# Altium schematic sheet BW1097_EthernetSchDoc.SchDoc: =project_title
size Tabloid; CompanyName: Luxonis Holding; Organization: Luxonis Holding; Address1: 1925 Harmony Park Drive; Address2: Westminster, CO; Address3: 80234; Address4: United States; SheetNumber: 16; SheetTotal: 17
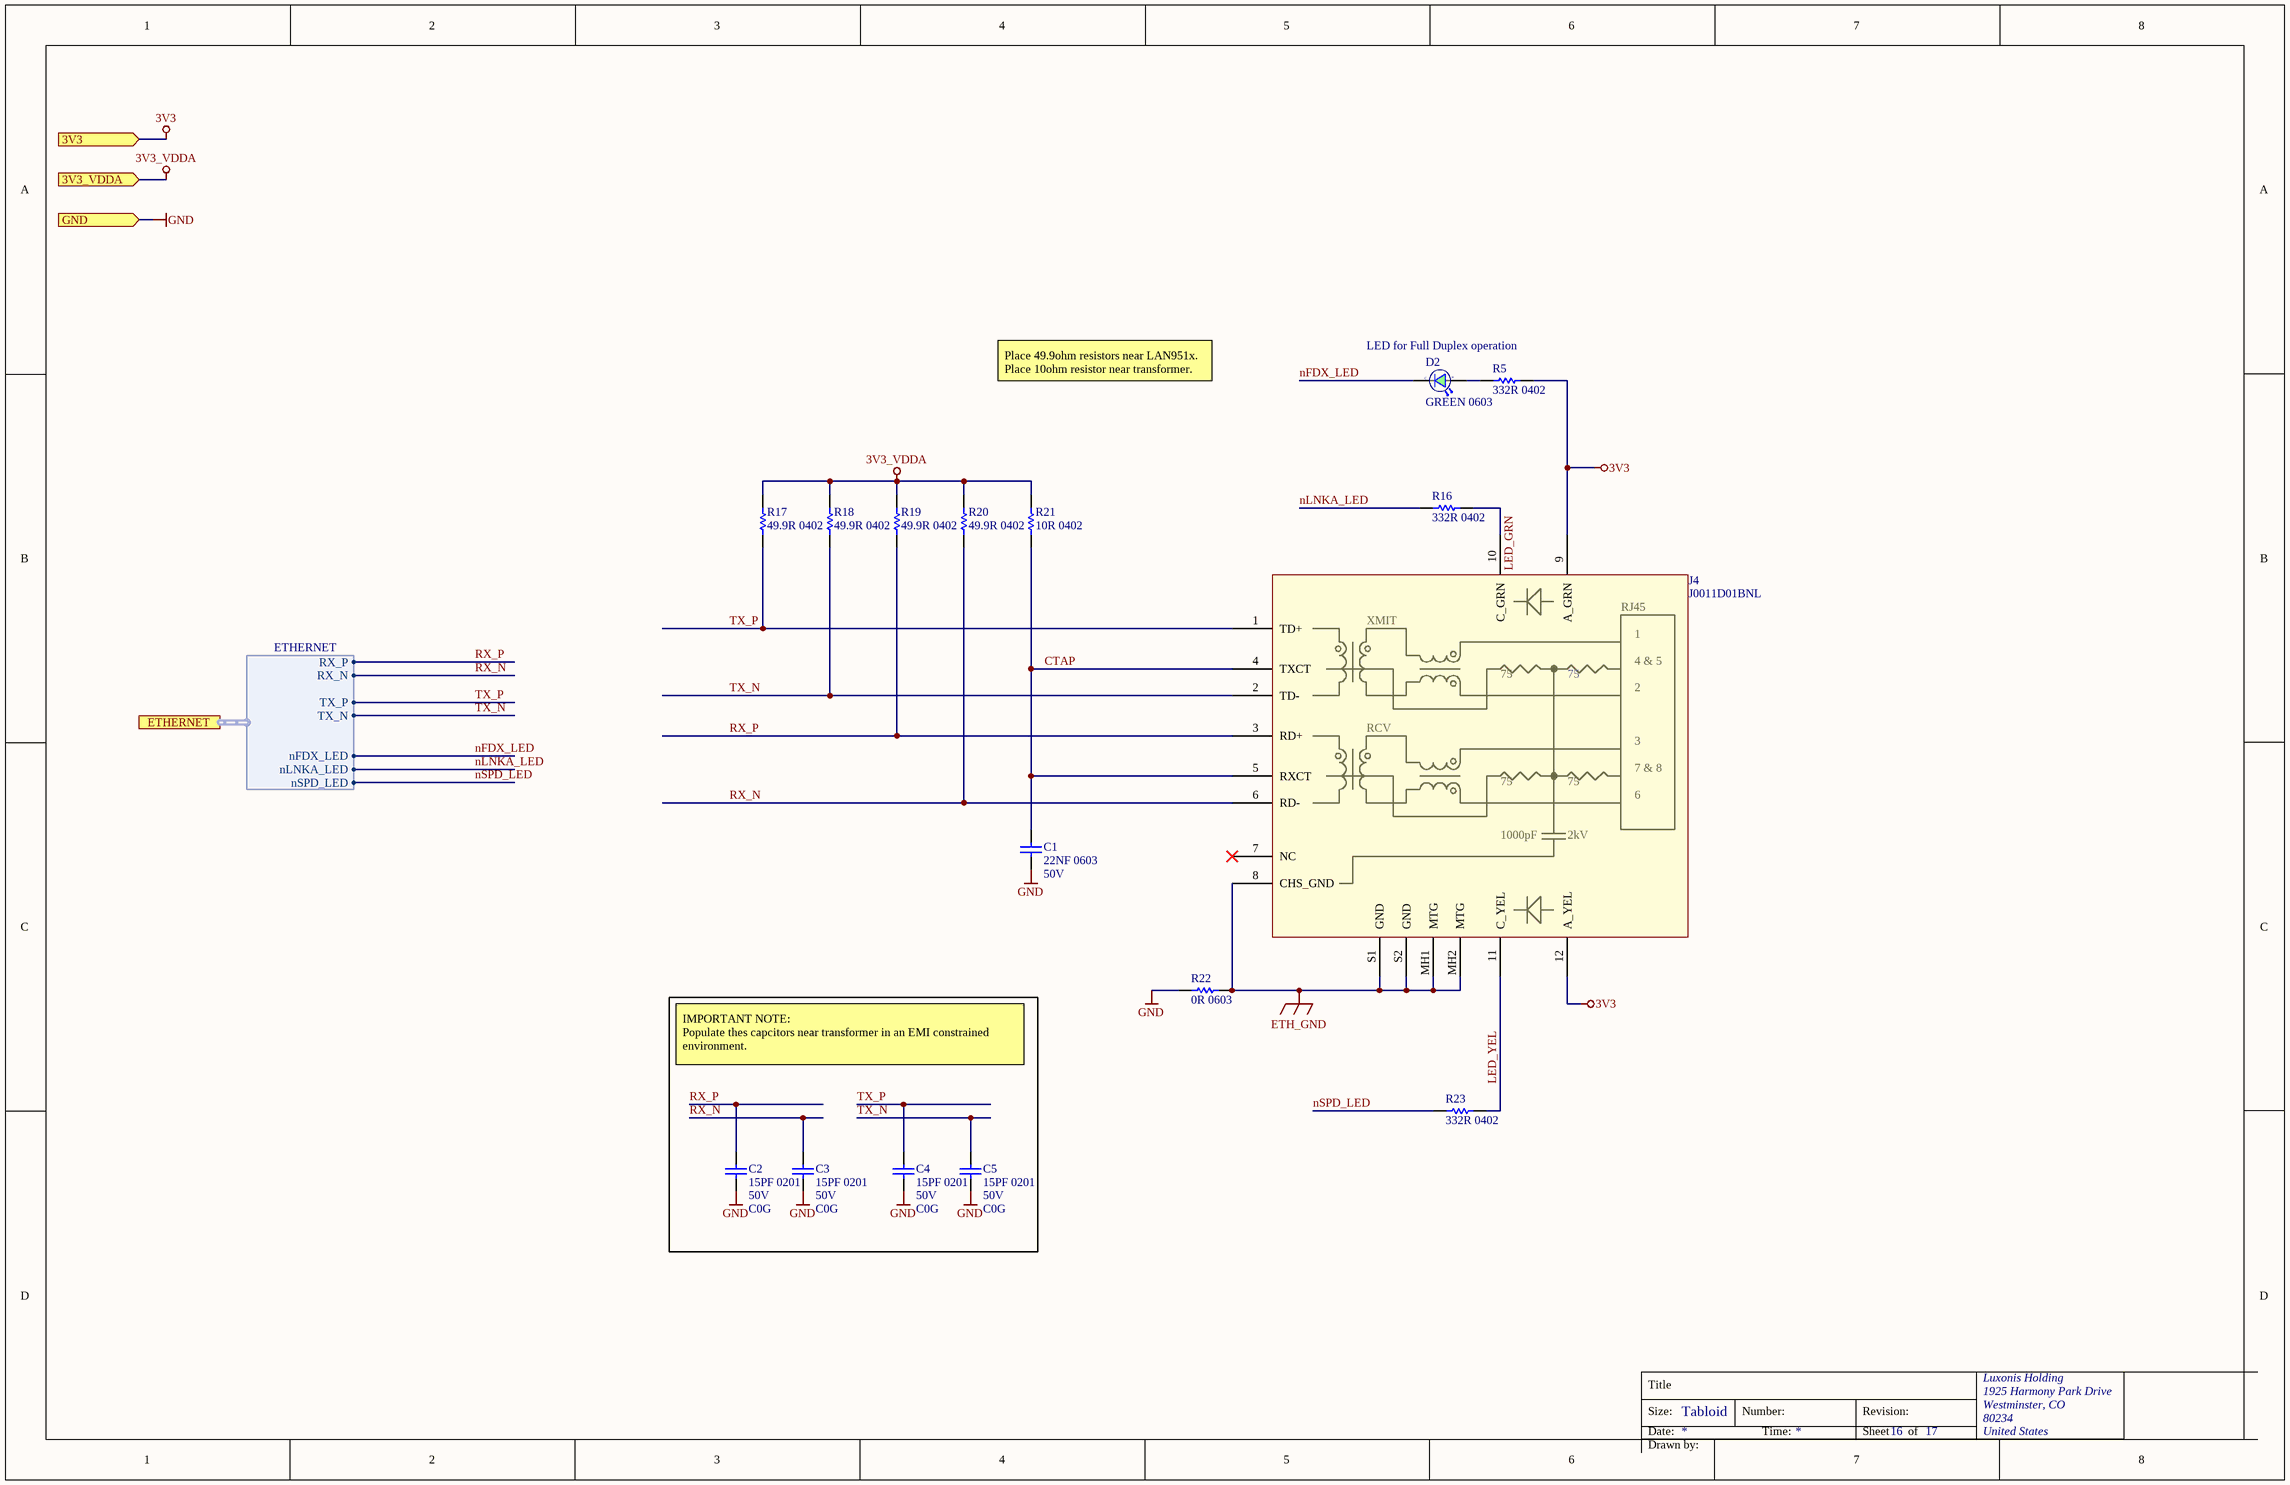
[diagram p0: BW1097_EthernetSchDoc.SchDoc]

## Parts
C1  22NF 0603  Voltage: 50V  [CAPC0603(1608)100_N]
C2  15PF 0201  Voltage: 50V  Dielectric: C0G  [CAPC0201(0603)33_L]
C3  15PF 0201  Voltage: 50V  Dielectric: C0G  [CAPC0201(0603)33_L]
C4  15PF 0201  Voltage: 50V  Dielectric: C0G  [CAPC0201(0603)33_L]
C5  15PF 0201  Voltage: 50V  Dielectric: C0G  [CAPC0201(0603)33_L]
D2  GREEN 0603  [SML_D1xx8W]
J4  J0011D01BNL  [J0011D01BNL]
R5  332R 0402  [RESC0402(1005)_N]
R16  332R 0402  [RESC0402(1005)_N]
R17  49.9R 0402  [RESC0402(1005)_N]
R18  49.9R 0402  [RESC0402(1005)_N]
R19  49.9R 0402  [RESC0402(1005)_N]
R20  49.9R 0402  [RESC0402(1005)_N]
R21  10R 0402  [RESC0402(1005)_N]
R22  0R 0603  [RESC0603(1608)_N]
R23  332R 0402  [RESC0402(1005)_N]

## Ports
3V3 (in), 3V3_VDDA (in), ETHERNET (harness ETHERNET), GND (in)

## Harnesses
ETHERNET: RX_P, RX_N, TX_P, TX_N, nFDX_LED, nLNKA_LED, nSPD_LED

## Nets
3V3: J4.9(A_GRN) J4.12(A_YEL) R5.2 ; port 3V3
3V3_VDDA: R17.2 R18.2 R19.2 R20.2 R21.2 ; port 3V3_VDDA
ETH_GND: J4.8(CHS_GND) J4.MH1(MTG) J4.MH2(MTG) J4.S1(GND) J4.S2(GND) R22.2
GND: C1.1 C2.1 C3.1 C4.1 C5.1 R22.1 ; port GND
CTAP: C1.2 J4.4(TXCT) J4.5(RXCT) R21.1
LED_GRN: J4.10(C_GRN) R16.2
LED_YEL: J4.11(C_YEL) R23.2
nFDX_LED: D2.1(C) ; port ETHERNET.nFDX_LED
nLNKA_LED: R16.1 ; port ETHERNET.nLNKA_LED
nSPD_LED: R23.1 ; port ETHERNET.nSPD_LED
RX_N: C3.2 J4.6(RD-) R20.1 ; port ETHERNET.RX_N
RX_P: C2.2 J4.3(RD+) R19.1 ; port ETHERNET.RX_P
TX_N: C5.2 J4.2(TD-) R18.1 ; port ETHERNET.TX_N
TX_P: C4.2 J4.1(TD+) R17.1 ; port ETHERNET.TX_P
NetD2_2: D2.2(A) R5.1

Not connected (* = marked no-connect by the designer): J4 7(NC)*

## Notes on the sheet
- LED for Full Duplex operation
- Place 49.9ohm resistors near LAN951x.
  Place 10ohm resistor near transformer.
- IMPORTANT NOTE:
  Populate thes capcitors near transformer in an EMI constrained environment.
- Title
- Size:
- Date:
- Tabloid
- Number:
- Time:
- Revision:
- Sheet
- of
- Drawn by:
- (in symbol J0011D01BNL) XMIT; 4 & 5; 75; RCV; 7 & 8; 1000pF; 2kV

## Library data of the parts
C1 = C0603C223K5RACTU: CAP CER 0.022UF 50V X7R 0603; Manufacturer 1: KEMET; Dielectric Material: Ceramic; Tolerance: 10%; Dissipation Factor: 2.5%; Manufacturer Part Number 1: C0603C223K5RACTU; Supplier 1: Digi-Key; Stock 1: 77845; Pricing 1: 1=0.10000, 10=0.06400, 100=0.02850, 500=0.02036, 1000=0.01600 (USD); RoHS: Yes; Mount: Surface Mount,PCB; Case/Package: 0603; Number of Pins: 2; Case Code (Imperial): 0603; Case Code (Metric): 1608; Contact Plating: Tin,Matte; Min Operating Temperature: -55°C; Max Operating Temperature: 125°C; Capacitance: 22nF; Packaging: Tape and Reel; Voltage Rating (DC): 50V; Dielectric: X7R; Package Quantity: 4000; Termination: SMD/SMT; Voltage Rating: 50V; Length: 1.6mm; Height: 0.8mm; Depth: 0.8mm; Width: 0.8mm; Thickness: 0.034inch; Lead Pitch: 0.7mm; Radiation Hardening: No; REACH SVHC: No SVHC; ComponentLink1URL: https://datasheet.ciiva.com/7823/1776091-7823698.pdf?src-supplier=Element14; ComponentLink1Description: https://datasheet.ciiva.com/7823/1776091-7823698.pdf?src-supplier=Element14; ComponentLink2URL: https://datasheet.ciiva.com/7824/kem-c1002-x7r-smd-7824021.pdf?src-supplier=Element14; ComponentLink2Description: https://datasheet.ciiva.com/7824/kem-c1002-x7r-smd-7824021.pdf?src-supplier=Element14; Supplier 2: Mouser; Supplier Part Number 1: 399-1280-6-ND; Supplier Part Number 2: 80-C0603C223K5R
C2-C5 = GRM0335C1H150JA01D: CAP CER 15PF 50V C0G/NP0 0201; Manufacturer 1: Murata; Tolerance: 5%; Manufacturer Part Number 1: GRM0335C1H150JA01D; Supplier 1: Digi-Key; Stock 1: 667552; Pricing 1: 1=0.10000, 10=0.01500, 100=0.00680, 500=0.00484, 1000=0.00380, 2500=0.00345, 5000=0.00317 (USD); RoHS: Yes; Mount: Surface Mount; Case/Package: 0201; Case Code (Metric): 0603; Case Code (Imperial): 0201; Min Operating Temperature: -55°C; Max Operating Temperature: 125°C; Capacitance: 15pF; Packaging: Tape and Reel; Voltage Rating: 50V; Voltage Rating (DC): 50V; Package Quantity: 1; Termination: SMD/SMT; Length: 0.6mm; Height: 0.3mm; Width: 0.012inch; Thickness: 0.013inch; Depth: 0.3mm; Radiation Hardening: No; Lead Free: Lead Free; REACH SVHC: No SVHC; ComponentLink1URL: https://datasheet.ciiva.com/11608/product-11608680.pdf?src-supplier=Avnet; ComponentLink1Description: https://datasheet.ciiva.com/11608/product-11608680.pdf?src-supplier=Avnet; ComponentLink2URL: https://datasheet.ciiva.com/26843/getdatasheetpartid-707838-26843722.pdf?src-supplier=Verical; ComponentLink2Description: https://datasheet.ciiva.com/26843/getdatasheetpartid-707838-26843722.pdf?src-supplier=Verical; ComponentLink3URL: https://datasheet.ciiva.com/14906/partnumbering-e-01-14906504.pdf?src-supplier=Digi-Key; ComponentLink3Description: https://datasheet.ciiva.com/14906/partnumbering-e-01-14906504.pdf?src-supplier=Digi-Key; ComponentLink4URL: https://datasheet.ciiva.com/5445/product-5445691.pdf?src-supplier=Mouser; ComponentLink4Description: https://datasheet.ciiva.com/5445/product-5445691.pdf?src-supplier=Mouser; Supplier 2: Mouser; Supplier Part Number 1: 490-6116-1-ND; Supplier Part Number 2: 81-GRM0335C1H150JA1D
D2 = SML-D12M8WT86: LED GREEN DIFFUSED 0603 SMD Green 572nm LED Indication - Discrete 2.2V 0603 (1608 Metric); Manufacturer: Rohm; Colour: Green,Yellow; Lens Colour: White,Clear,Diffused; Lens Style: Diffused,Colorless,Rectangular; Forward Current: 20mA; Luminous Intensity: 25mcd; Number of LEDs: 1; Viewing Angle: 160°; Lens Color: White,Diffused; Supplier 1: Digi-Key; Manufacturer Part Number: SML-D12M8WT86; Stock 1: 112971; Pricing 1: 1=0.33000, 10=0.23900, 100=0.11340, 500=0.07560, 1000=0.05922 (USD); Mount: Surface Mount; Case/Package: 0603; Number of Pins: 2; Case Code (Metric): 1608; Case Code (Imperial): 0603; Min Operating Temperature: -40°C; Max Operating Temperature: 85°C; Forward Voltage: 2.2V; Packaging: Tape and Reel; Dominant Wavelength: 572nm; Wavelength: 572nm; Illumination Colour: Green; Package Quantity: 1; Test Current: 20mA; Lens Transparency: Diffused; Length: 1.6mm; Height: 0.65mm; Width: 0.8mm; Radiation Hardening: No; REACH SVHC: Unknown; Lead Free: Lead Free; ComponentLink1URL: https://datasheet.ciiva.com/11774/0900766b80df3ada-11774260.pdf; ComponentLink1Description: https://datasheet.ciiva.com/11774/0900766b80df3ada-11774260.pdf; ComponentLink2URL: https://datasheet.ciiva.com/3161/sml-d1-3161419.pdf; ComponentLink2Description: https://datasheet.ciiva.com/3161/sml-d1-3161419.pdf; ComponentLink3URL: https://datasheet.ciiva.com/2110/sml-d1-2110396.pdf; ComponentLink3Description: https://datasheet.ciiva.com/2110/sml-d1-2110396.pdf; ComponentLink4URL: https://datasheet.ciiva.com/2110/sml-d1-2110397.pdf; ComponentLink4Description: https://datasheet.ciiva.com/2110/sml-d1-2110397.pdf; ComponentLink5URL: https://datasheet.ciiva.com/2110/sml-d1-2110398.pdf; ComponentLink5Description: https://datasheet.ciiva.com/2110/sml-d1-2110398.pdf; Manufacturer 1: Rohm; Manufacturer Part Number 1: SML-D12M8WT86; RoHS: Yes; Color: Green,Yellow; Illumination Color: Green; ComponentLink6URL: https://datasheet.ciiva.com/11774/0900766b80df3ada-11774260.pdf?src-supplier=RSComponents; ComponentLink6Description: https://datasheet.ciiva.com/11774/0900766b80df3ada-11774260.pdf?src-supplier=RSComponents; ComponentLink7URL: https://datasheet.ciiva.com/3161/sml-d1-3161419.pdf?src-supplier=Avnet; ComponentLink7Description: https://datasheet.ciiva.com/3161/sml-d1-3161419.pdf?src-supplier=Avnet; ComponentLink8URL: https://datasheet.ciiva.com/2110/sml-d1-2110396.pdf?src-supplier=Digi-Key; ComponentLink8Description: https://datasheet.ciiva.com/2110/sml-d1-2110396.pdf?src-supplier=Digi-Key; ComponentLink9URL: https://datasheet.ciiva.com/2110/sml-d1-2110397.pdf?src-supplier=Digi-Key; ComponentLink9Description: https://datasheet.ciiva.com/2110/sml-d1-2110397.pdf?src-supplier=Digi-Key; ComponentLink10URL: https://datasheet.ciiva.com/2110/sml-d1-2110398.pdf?src-supplier=Digi-Key; ComponentLink10Description: https://datasheet.ciiva.com/2110/sml-d1-2110398.pdf?src-supplier=Digi-Key; Supplier Part Number 1: 511-1578-1-ND
J4 = J0011D01BNL: CONN MAGJACK 1PORT 100 BASE-TX 1 Port RJ45 Magjack Connector Through Hole 10/100 Base-TX, AutoMDIX; Manufacturer 1: Pulse; Number of Contacts: 8; Shielding: Shielded; Gender: Female; Current Rating: 8mA; Number of Ports: 1; Direction: Down; Number of Cores per Jack: 4; Pitch: 2.54mm; Manufacturer Part Number 1: J0011D01BNL; Supplier 1: Digi-Key; Stock 1: 2382; Pricing 1: 1=7.92000, 10=7.59000, 25=6.93000, 50=6.60000, 100=6.27000, 250=5.61000, 500=5.28000, 1000=4.62000 (USD); RoHS: Yes; Mount: Through Hole; Contact Plating: Gold; Contact Material: Bronze; Color: Green,Yellow; Housing Material: Thermoplastic; Min Operating Temperature: 0°C; Max Operating Temperature: 70°C; Termination: Solder; Orientation: Right Angle; Package Quantity: 30; Number of Rows: 1; Packaging: Tray; Connector Type: RJ45; Number of Positions Loaded: 8; Length: 16.26mm; Depth: 21.59mm; Radiation Hardening: No; Lead Free: Lead Free; ComponentLink1URL: https://datasheet.ciiva.com/3138/+j403-3138718.pdf?src-supplier=Avnet; ComponentLink1Description: https://datasheet.ciiva.com/3138/+j403-3138718.pdf?src-supplier=Avnet; ComponentLink2URL: https://datasheet.ciiva.com/16650/+j403-16650550.pdf?src-supplier=Avnet+Europe; ComponentLink2Description: https://datasheet.ciiva.com/16650/+j403-16650550.pdf?src-supplier=Avnet+Europe; Supplier Part Number 1: 553-1483-ND; Supplier 2: Arrow; Supplier 3: Mouser; Supplier 4: TTI; Supplier Part Number 2: J0011D01BNL; Supplier Part Number 3: 673-J0011D01BNL; Supplier Part Number 4: J0011D01BNL
R5 R16 R23 = RC0402FR-07332RL: RES SMD 332 OHM 1% 1/16W 0402; Manufacturer 1: Yageo; Temperature Coefficient: 100ppm/°C; Power Rating: 62.5mW; Voltage Rating: 50V; Manufacturer Part Number 1: RC0402FR-07332RL; Supplier 1: Digi-Key; Stock 1: 2789251; Pricing 1: 1=0.10000, 10=0.01600, 100=0.00640, 1000=0.00289, 2500=0.00251, 5000=0.00207 (USD); RoHS: Yes; Case/Package: 0402; Weight: 2.3E-05oz; Case Code (Imperial): 0402; Case Code (Metric): 1005; Min Operating Temperature: -55°C; Max Operating Temperature: 155°C; Packaging: Tape and Reel; Resistance: 332R; Tolerance: 1%; Composition: Thick Film; Voltage Rating (DC): 50V; Termination: SMD/SMT; Military Standard: Not; Length: 1mm; Height: 0.35mm; Width: 0.5mm; Depth: 0.5mm; Lead Free: Lead Free; ComponentLink1URL: https://datasheet.ciiva.com/16929/pyu-rc0402-51-rohs-l-6-r-16929351.pdf?src-supplier=Future+Electronics; ComponentLink1Description: https://datasheet.ciiva.com/16929/pyu-rc0402-51-rohs-l-6-r-16929351.pdf?src-supplier=Future+Electronics; Supplier 2: Mouser; Supplier Part Number 1: 311-332LRCT-ND; Supplier Part Number 2: 603-RC0402FR-07332RL
R17-R20 = RC0402FR-0749R9L: RES SMD 49.9 OHM 1% 1/16W 0402; Manufacturer 1: Yageo; Power Rating: 62.5mW; Temperature Coefficient: 100ppm/°C; Voltage Rating: 50V; Max Power Dissipation: 63mW; Manufacturer Part Number 1: RC0402FR-0749R9L; Supplier 1: Digi-Key; Stock 1: 15110719; Pricing 1: 1=0.10000, 10=0.01600, 100=0.00640, 1000=0.00289, 2500=0.00251, 5000=0.00207 (USD); RoHS: Yes; Case/Package: 0402; Number of Pins: 2; Case Code (Imperial): 0402; Case Code (Metric): 1005; Min Operating Temperature: -55°C; Max Operating Temperature: 155°C; Packaging: Tape and Reel; Resistance: 49.9R; Tolerance: 1%; Composition: Thick Film; Number of Terminations: 2; Package Quantity: 1; Termination: SMD/SMT; Military Standard: Not; Voltage Rating (DC): 50V; Features: Moisture Resistant; Working Voltage: 50V; Length: 1mm; Height: 0.016inch; Width: 0.5mm; Depth: 0.5mm; Lead Free: Lead Free; REACH SVHC: No SVHC; ComponentLink1URL: https://datasheet.ciiva.com/11819/0900766b80c66297-11819508.pdf?src-supplier=RSComponents; ComponentLink1Description: https://datasheet.ciiva.com/11819/0900766b80c66297-11819508.pdf?src-supplier=RSComponents; ComponentLink2URL: https://datasheet.ciiva.com/7983/1018594-7983542.pdf?src-supplier=Element14; ComponentLink2Description: https://datasheet.ciiva.com/7983/1018594-7983542.pdf?src-supplier=Element14; ComponentLink3URL: https://datasheet.ciiva.com/16743/pyu-rc0402-51-rohs-l-6-r-16743942.pdf?src-supplier=Future+Electronics; ComponentLink3Description: https://datasheet.ciiva.com/16743/pyu-rc0402-51-rohs-l-6-r-16743942.pdf?src-supplier=Future+Electronics; ComponentLink4URL: https://datasheet.ciiva.com/22747/1018594-22747514.pdf?src-supplier=Element14; ComponentLink4Description: https://datasheet.ciiva.com/22747/1018594-22747514.pdf?src-supplier=Element14; ComponentLink5URL: https://datasheet.ciiva.com/2453/pyu-r-int-thick-7-2453355.pdf?src-supplier=Digi-Key; ComponentLink5Description: https://datasheet.ciiva.com/2453/pyu-r-int-thick-7-2453355.pdf?src-supplier=Digi-Key; ComponentLink6URL: https://datasheet.ciiva.com/2453/pyu-r-int-thick-7-2453356.pdf?src-supplier=Digi-Key; ComponentLink6Description: https://datasheet.ciiva.com/2453/pyu-r-int-thick-7-2453356.pdf?src-supplier=Digi-Key; ComponentLink7URL: https://datasheet.ciiva.com/2453/pyu-r-int-thick-7-2453357.pdf?src-supplier=Digi-Key; ComponentLink7Description: https://datasheet.ciiva.com/2453/pyu-r-int-thick-7-2453357.pdf?src-supplier=Digi-Key; Supplier 2: Mouser; Supplier Part Number 1: 311-49.9LRCT-ND; Supplier Part Number 2: 603-RC0402FR-0749R9L
R21 = RC0402FR-0710RL: RES SMD 10 OHM 1% 1/16W 0402; Manufacturer 1: Yageo; Power Rating: 63mW; Voltage Rating: 50V; Temperature Coefficient: 100ppm/°C; Manufacturer Part Number 1: RC0402FR-0710RL; Supplier 1: Digi-Key; Stock 1: 9523799; Pricing 1: 1=0.10000, 10=0.02400, 100=0.00970, 1000=0.00435, 2500=0.00377, 5000=0.00312 (USD); RoHS: Yes; Case/Package: 0402; Case Code (Imperial): 0402; Case Code (Metric): 1005; Min Operating Temperature: -55°C; Max Operating Temperature: 155°C; Tolerance: 1%; Resistance: 10R; Packaging: Tape and Reel; Termination: SMD/SMT; Composition: Thick Film; Military Standard: Not; Number of Terminations: 2; Working Voltage: 50V; Length: 1mm; Height: 0.32mm; Depth: 0.5mm; REACH SVHC: Unknown; Lead Free: Lead Free; ComponentLink1URL: https://datasheet.ciiva.com/11808/0900766b80c66297-11808764.pdf?src-supplier=RSComponents; ComponentLink1Description: https://datasheet.ciiva.com/11808/0900766b80c66297-11808764.pdf?src-supplier=RSComponents; ComponentLink2URL: https://datasheet.ciiva.com/7849/1018594-7849818.pdf?src-supplier=Element14; ComponentLink2Description: https://datasheet.ciiva.com/7849/1018594-7849818.pdf?src-supplier=Element14; ComponentLink3URL: https://datasheet.ciiva.com/46394/1018594-46394954.pdf?src-supplier=Element14; ComponentLink3Description: https://datasheet.ciiva.com/46394/1018594-46394954.pdf?src-supplier=Element14; ComponentLink4URL: https://datasheet.ciiva.com/7849/1018594-7849819.pdf?src-supplier=Element14; ComponentLink4Description: https://datasheet.ciiva.com/7849/1018594-7849819.pdf?src-supplier=Element14; ComponentLink5URL: https://datasheet.ciiva.com/15189/getdatasheetpartid-323697-15189339.pdf?src-supplier=Verical; ComponentLink5Description: https://datasheet.ciiva.com/15189/getdatasheetpartid-323697-15189339.pdf?src-supplier=Verical; Supplier 2: Mouser; Supplier Part Number 1: 311-10.0LRCT-ND; Supplier Part Number 2: 603-RC0402FR-0710RL
R22 = CRCW06030000Z0EA: RES SMD 0 OHM JUMPER 1/10W 0603 0 Ohms Jumper 0.1W, 1/10W Chip Resistor 0603 (1608 Metric) Automotive AEC-Q200 Thick Film; Manufacturer 1: Vishay; Manufacturer Part Number 1: CRCW0603-0000Z0EA; Resistance: 0mR; Power Rating: 100mW; Voltage Rating: 75V; Temperature Coefficient: 100ppm/°C; Tolerance: 5%; Current Rating: 2A; Supplier 1: Digi-Key; Stock 1: 742743; Pricing 1: 1=0.100000, 10=0.034000, 25=0.024400, 50=0.018600, 100=0.013800, 250=0.010480, 500=0.008400, 1000=0.006180 (USD); RoHS: Yes; Mount: Surface Mount; Case/Package: 0603; Weight: 7.1E-05oz; Contact Plating: Tin,Lead; Case Code (Metric): 1608; Case Code (Imperial): 0603; Min Operating Temperature: -55°C; Max Operating Temperature: 155°C; Composition: Thick Film; Termination: SMD/SMT; Packaging: Tape and Reel; Package Quantity: 1; Number of Terminations: 2; Military Standard: Not; Max Power Dissipation: 100mW; Voltage Rating (DC): 75V; Features: Automotive AEC-Q200; Working Voltage: 75V; Length: 1.55mm; Height: 0.02inch; Width: 0.033inch; Depth: 0.85mm; Radiation Hardening: No; Lead Free: Lead Free; REACH SVHC: Unknown; ComponentLink1URL: https://datasheet.ciiva.com/2461/dcrcwe3-2461968.pdf?src-supplier=Digi-Key; ComponentLink1Description: https://datasheet.ciiva.com/2461/dcrcwe3-2461968.pdf?src-supplier=Digi-Key; ComponentLink2URL: https://datasheet.ciiva.com/2461/dcrcwe3-2461969.pdf?src-supplier=Digi-Key; ComponentLink2Description: https://datasheet.ciiva.com/2461/dcrcwe3-2461969.pdf?src-supplier=Digi-Key; ComponentLink3URL: https://datasheet.ciiva.com/2461/dcrcwe3-2461970.pdf?src-supplier=Digi-Key; ComponentLink3Description: https://datasheet.ciiva.com/2461/dcrcwe3-2461970.pdf?src-supplier=Digi-Key; ComponentLink4URL: https://datasheet.ciiva.com/8340/dcrcwe3-8340197.pdf?src-supplier=Avnet; ComponentLink4Description: https://datasheet.ciiva.com/8340/dcrcwe3-8340197.pdf?src-supplier=Avnet; ComponentLink5URL: https://datasheet.ciiva.com/16941/dcrcw-16941302.pdf?src-supplier=Avnet+Europe; ComponentLink5Description: https://datasheet.ciiva.com/16941/dcrcw-16941302.pdf?src-supplier=Avnet+Europe; ComponentLink6URL: https://datasheet.ciiva.com/16199/dcrcwe3-16199063.pdf?src-supplier=Future+Electronics; ComponentLink6Description: https://datasheet.ciiva.com/16199/dcrcwe3-16199063.pdf?src-supplier=Future+Electronics; ComponentLink7URL: https://datasheet.ciiva.com/16725/70201119-16725175.pdf?src-supplier=Allied+Electronics; ComponentLink7Description: https://datasheet.ciiva.com/16725/70201119-16725175.pdf?src-supplier=Allied+Electronics; ComponentLink8URL: https://datasheet.ciiva.com/26316/fld-crcw-e3-data-en-26316615.pdf?src-supplier=Distrelec; ComponentLink8Description: https://datasheet.ciiva.com/26316/fld-crcw-e3-data-en-26316615.pdf?src-supplier=Distrelec; ComponentLink9URL: https://datasheet.ciiva.com/5544/dcrcwe3-109170-5544344.pdf?src-supplier=Mouser; ComponentLink9Description: https://datasheet.ciiva.com/5544/dcrcwe3-109170-5544344.pdf?src-supplier=Mouser; ComponentLink10URL: https://datasheet.ciiva.com/7841/1720486-7841816.pdf?src-supplier=Element14; ComponentLink10Description: https://datasheet.ciiva.com/7841/1720486-7841816.pdf?src-supplier=Element14; ComponentLink11URL: https://datasheet.ciiva.com/7841/1720486-7841817.pdf?src-supplier=Element14; ComponentLink11Description: https://datasheet.ciiva.com/7841/1720486-7841817.pdf?src-supplier=Element14; ComponentLink12URL: https://datasheet.ciiva.com/7841/125364-7841818.pdf?src-supplier=Element14; ComponentLink12Description: https://datasheet.ciiva.com/7841/125364-7841818.pdf?src-supplier=Element14; ComponentLink13URL: https://datasheet.ciiva.com/16721/70201119-16721450.pdf?src-supplier=Allied+Electronics; ComponentLink13Description: https://datasheet.ciiva.com/16721/70201119-16721450.pdf?src-supplier=Allied+Electronics; Supplier Part Number 1: 541-0.0GCT-ND